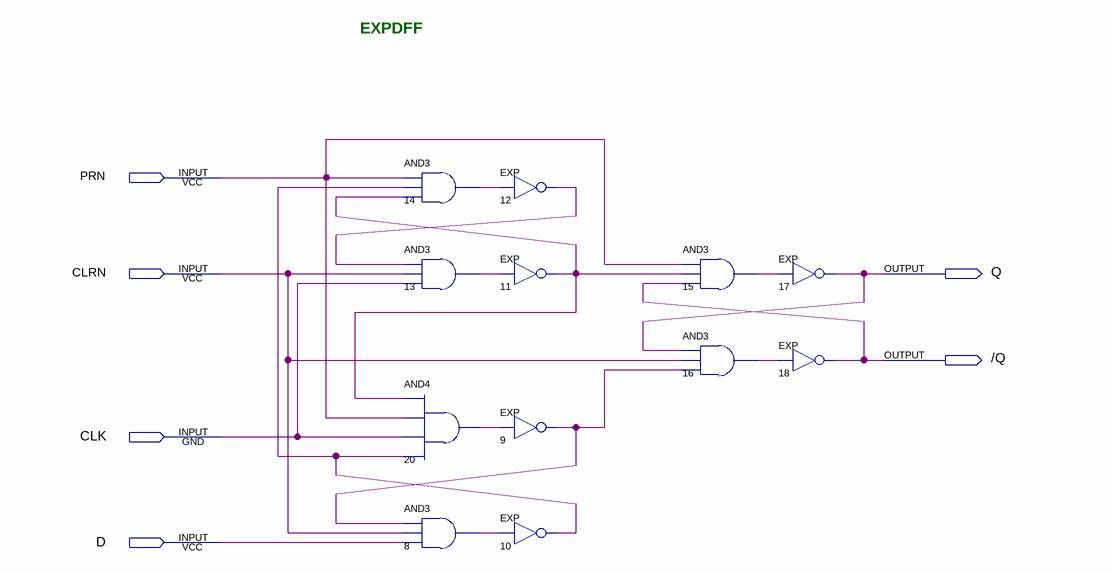
[diagram p0: schematic sheet]
// Quartus schematic pexpdff.bdf as structural Verilog: 12 symbols, 6 pins
module pexpdff (
  input  PRN,
  input  CLRN,
  input  CLK,
  input  D,
  output Q,
  output \/Q 
);

  wire n8_out, n9_out, n10_out, n11_out, n12_out, n13_out, n14_out, n15_out, n16_out, n20_out;

  and u_14 (n14_out, PRN, n10_out, n11_out);
  and u_13 (n13_out, n12_out, CLRN, CLK);
  and u_20 (n20_out, n11_out, PRN, CLK, n10_out);
  and u_8 (n8_out, n9_out, CLRN, D);
  EXP u_12 (.IN(n14_out), .OUT(n12_out));
  EXP u_11 (.IN(n13_out), .OUT(n11_out));
  EXP u_9 (.IN(n20_out), .OUT(n9_out));
  EXP u_10 (.IN(n8_out), .OUT(n10_out));
  and u_15 (n15_out, PRN, n11_out, \/Q );
  and u_16 (n16_out, Q, CLRN, n9_out);
  EXP u_17 (.IN(n15_out), .OUT(Q));
  EXP u_18 (.IN(n16_out), .OUT(\/Q ));

  // Notes on the sheet:
  //   EXPDFF
endmodule
